# Altium schematic sheet T 1500  C.SchDoc
size 203 x 193 mm
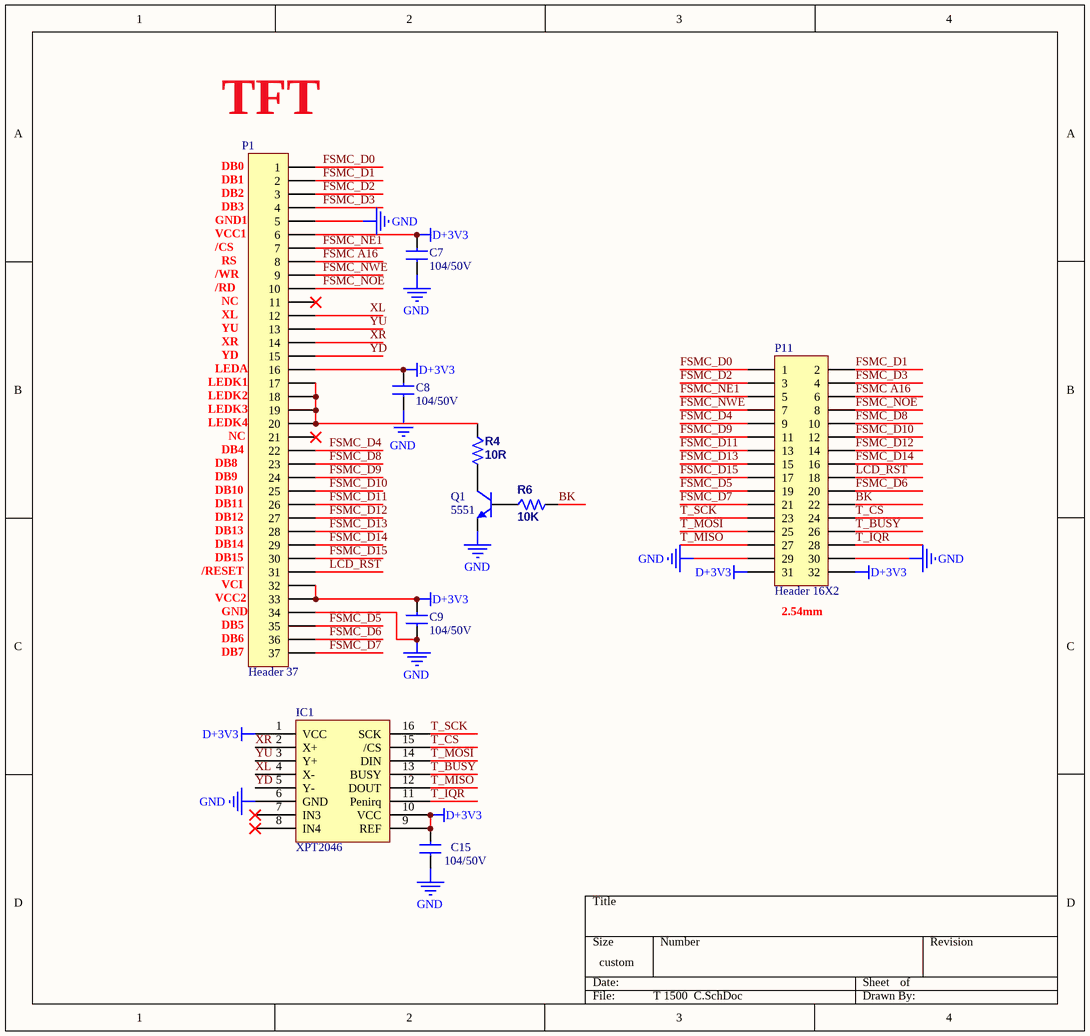
[diagram p0: T 1500  C.SchDoc]

## Parts
C7  104/50V  [C0805]
C8  104/50V  [C0805]
C9  104/50V  [C0805]
C15  104/50V  [C0805]
IC1  XPT2046  [SOT403-1_L]
P1  Header 37  [HDR1X30]
P11  Header 16X2  [HDR2X16]
Q1  5551  [SOT-23]
R4  10R  [R0603]
R6  10K  [R0603]

## Nets
D+3V3: C7.1 C8.1 C9.1 C15.1 IC1.1(VCC) IC1.9(REF) IC1.10(VCC) P1.6 P1.16 P1.32 P1.33 P11.31 P11.32
GND: C7.2 C8.2 C9.2 C15.2 IC1.6(GND) P1.5 P1.34 P11.29 P11.30 Q1.2(E)
BK: P11.22 R6.2
FSMC A16: P1.8 P11.6
FSMC_D0: P1.1 P11.1
FSMC_D1: P1.2 P11.2
FSMC_D2: P1.3 P11.3
FSMC_D3: P1.4 P11.4
FSMC_D4: P1.22 P11.9
FSMC_D5: P1.35 P11.19
FSMC_D6: P1.36 P11.20
FSMC_D7: P1.37 P11.21
FSMC_D8: P1.23 P11.10
FSMC_D9: P1.24 P11.11
FSMC_D10: P1.25 P11.12
FSMC_D11: P1.26 P11.13
FSMC_D12: P1.27 P11.14
FSMC_D13: P1.28 P11.15
FSMC_D14: P1.29 P11.16
FSMC_D15: P1.30 P11.17
FSMC_NE1: P1.7 P11.5
FSMC_NOE: P1.10 P11.8
FSMC_NWE: P1.9 P11.7
LCD_RST: P1.31 P11.18
T_BUSY: IC1.13(BUSY) P11.26
T_CS: IC1.15(/CS) P11.24
T_IQR: IC1.11(Penirq) P11.28
T_MISO: IC1.12(DOUT) P11.27
T_MOSI: IC1.14(DIN) P11.25
T_SCK: IC1.16(SCK) P11.23
XL: IC1.4(X-) P1.12
XR: IC1.2(X+) P1.14
YD: IC1.5(Y-) P1.15
YU: IC1.3(Y+) P1.13
NetP1_17: P1.17 P1.18 P1.19 P1.20 R4.1
NetQ1_1: Q1.1(B) R6.1
NetQ1_3: Q1.3(C) R4.2

Not connected (* = marked no-connect by the designer): IC1 7(IN3)* 8(IN4)*; P1 11* 21*

## Notes on the sheet
- (near P1) DB0
- (near P1) TFT
- (near P1) GND1
- (near P1) VCC1
- /CS
- (near P1) DB1
- (near P1) DB2
- (near P1) DB3
- /WR
- /RD
- RS
- NC
- (near P1) LEDK1
- (near P1) LEDA
- XL
- YU
- XR
- YD
- (near P1) LEDK2
- (near P1) LEDK3
- (near P1) LEDK4
- (near P1) NC
- DB8
- DB9
- (near P1) DB10
- (near P1) DB11
- (near P1) DB12
- (near P1) DB4
- (near P1) /RESET
- (near P1) DB13
- (near P1) DB14
- (near P1) DB15
- (near P1) VCC2
- (near P1) VCI
- (near P1) GND
- (near P1) DB5
- (near P1) DB6
- (near P1) DB7
- (near P11) 2.54mm

## Library data of the parts
C7-C9 C15 = CAP: 无极性电容器
IC1 = ADS7843
P1 = Header 37: Header, 30-Pin; LatestRevisionDate: 17-Jul-2002; LatestRevisionNote: Re-released for DXP Platform.; Publisher: Altium Limited
P11 = Header 16X2: Header, 16-Pin, Dual row; LatestRevisionDate: 17-Jul-2002; LatestRevisionNote: Re-released for DXP Platform.; Publisher: Altium Limited
Q1 = 2N5551: NPN(160V/0.6A/0.6W/100MHz/E.B.C); Revision 1: 11-Jul-2000: SIM Model Added.; Revision 2: 17-Jul-2002: Re-released for DXP Platform.; Revision 3: 15-Jan-2003: PCB Footprint 'BCY-W3/D4.7' replaced; Code - JEDEC: TO-92A; Published: 8-Jun-2000; Datasheet: Latest Revision: 1997; Package Reference: TO-92A; Publisher: Altium Limited
R4 R6 = RES2-S